# EAGLE board uClouds_002 (EAGLE 7.1.0)
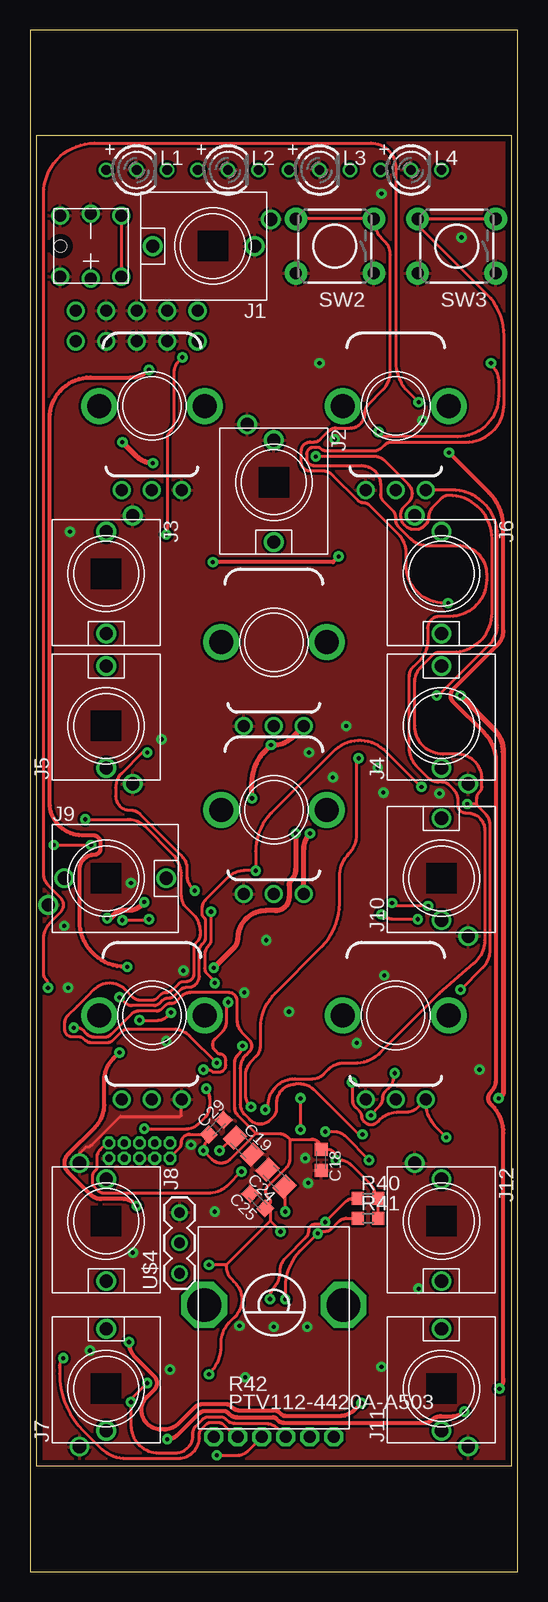
[diagram p4: board, top side]
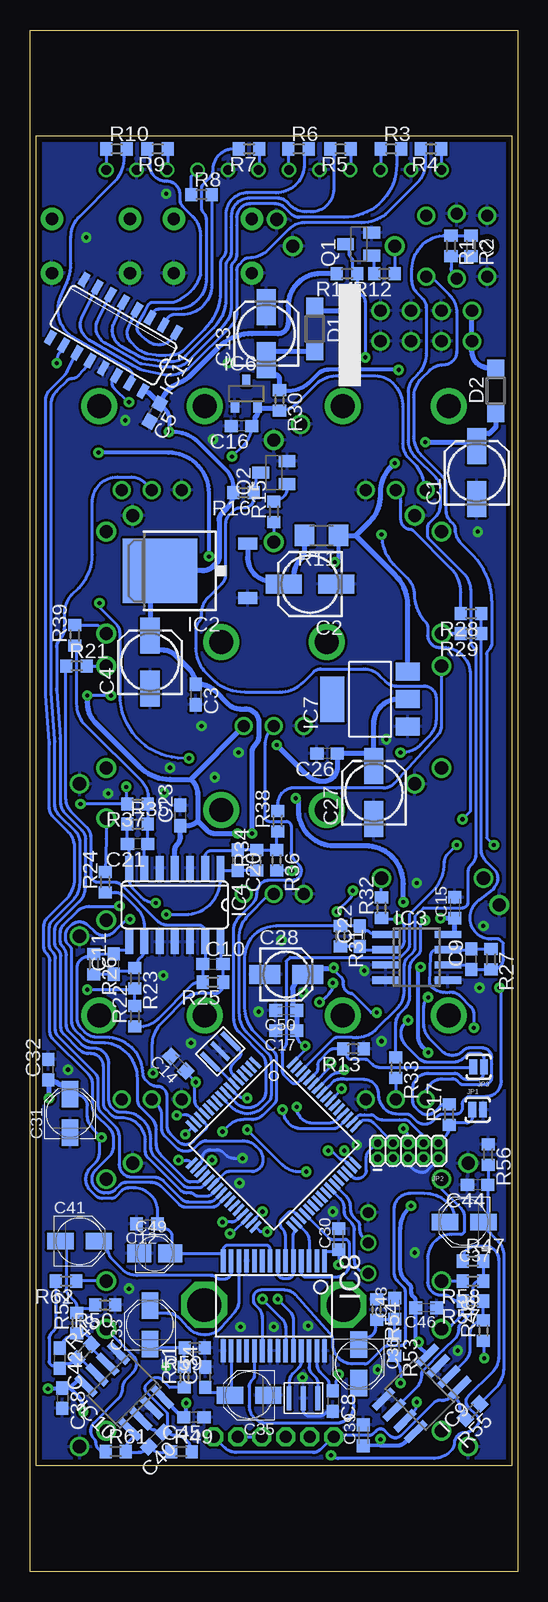
[diagram p5: board, bottom side, seen from below]

Size 40.64 x 128.5 mm. Coordinates in mm from the lower left corner, seen from the top.
Outline: 0.5,8.8 40.14,8.8 40.14,119.7 0.5,119.7 0.5,8.8
Outline: 0,0 40.64,0 40.64,128.5 0,128.5 0,0
Copper layers (1*16): Top 0.035mm / dielectric 1.5mm / Bottom 0.035mm
Design rules "pcbCartStandars *": minimum track width 8mil, minimum drill 0.4mm, track to track 8mil, track to pad 8mil, pad to pad 8mil, via to via 8mil, smd to smd 8mil, copper to edge 20mil, drill to drill 8mil, minimum pad ring 8mil, minimum via ring 10mil, stop-mask expansion 3mil, vias tented up to drill 25mil, thermal gap 8mil

## Footprints (pad centres in the part's own frame; a part is rotated, then mirrored left to right if it is on the bottom)
Q-POT2 = drill 1 pad 1.5: P$1 -2.5,-7; P$2 0,-7; P$3 2.5,-7 | drill 2 pad 2.5: P$4 -4.4,0; P$5 4.4,0
153CLV-0505 = smd 3 x 1.6: + 2.2,0; - -2.2,0
C0603 = smd 1.1 x 1: 1 -0.85,0; 2 0.85,0
C0603K = smd 1.05 x 1.08: 1 -0.875,0; 2 0.875,0
C0805K = smd 1.3 x 1.6: 1 -1,0; 2 1,0
153CLV-0405 = smd 2.6 x 1.6: + 1.8,0; - -1.8,0
PANASONIC_B = smd 2.2 x 1.4: + 1.6,0; - -1.6,0
PANASONIC_A = smd 2 x 1.5: + 1.3,0; - -1.3,0
SOD123 = smd 1.4 x 1.4: A 1.9,0; C -1.9,0
FIDUCIAL-1X2 = smd 1 x 1: 1 0,0
TO252 = smd 1 x 1.6: 1 -2.28,-4.8; 2 2.28,-4.8 | smd 5.4 x 6.2: 3 0,2.5
SO08 = smd 0.6 x 2.2: 1 -1.905,-2.6; 2 -0.635,-2.6; 3 0.635,-2.6; 4 1.905,-2.6; 5 1.905,2.6; 6 0.635,2.6; 7 -0.635,2.6; 8 -1.905,2.6
SO14 = smd 0.66 x 2.032: 1 -3.81,-3.073; 2 -2.54,-3.073; 3 -1.27,-3.073; 4 0,-3.073; 5 1.27,-3.073; 6 2.54,-3.073; 7 3.81,-3.073; 8 3.81,3.073; 9 2.54,3.073; 10 1.27,3.073; 11 0,3.073; 12 -1.27,3.073; 13 -2.54,3.073; 14 -3.81,3.073
TQFP-10X10-64 = smd 1.2 x 0.3: 1 -5.936,3.75; 2 -5.936,3.25; 3 -5.936,2.75; 4 -5.936,2.25; 5 -5.936,1.75; 6 -5.936,1.25; 7 -5.936,0.75; 8 -5.936,0.25; 9 -5.936,-0.25; 10 -5.936,-0.75; 11 -5.936,-1.25; 12 -5.936,-1.75; 13 -5.936,-2.25; 14 -5.936,-2.75; 15 -5.936,-3.25; 16 -5.936,-3.75; 33 5.886,-3.75; 34 5.886,-3.25; 35 5.886,-2.75; 36 5.886,-2.25; 37 5.886,-1.75; 38 5.886,-1.25; 39 5.886,-0.75; 40 5.886,-0.25; 41 5.886,0.25; 42 5.886,0.75; 43 5.886,1.25; 44 5.886,1.75; 45 5.886,2.25; 46 5.886,2.75; 47 5.886,3.25; 48 5.886,3.75 | smd 0.3 x 1.2: 17 -3.75,-5.911; 18 -3.25,-5.911; 19 -2.75,-5.911; 20 -2.25,-5.911; 21 -1.75,-5.911; 22 -1.25,-5.911; 23 -0.75,-5.911; 24 -0.25,-5.911; 25 0.25,-5.911; 26 0.75,-5.911; 27 1.25,-5.911; 28 1.75,-5.911; 29 2.25,-5.911; 30 2.75,-5.911; 31 3.25,-5.911; 32 3.75,-5.911; 49 3.75,5.936; 50 3.25,5.936; 51 2.75,5.936; 52 2.25,5.936; 53 1.75,5.936; 54 1.25,5.936; 55 0.75,5.936; 56 0.25,5.936; 57 -0.25,5.936; 58 -0.75,5.936; 59 -1.25,5.936; 60 -1.75,5.936; 61 -2.25,5.936; 62 -2.75,5.936; 63 -3.25,5.936; 64 -3.75,5.936
DBZ_R-PDSO-G3 = smd 0.7 x 1: 1 -0.95,-1.1; 2 0.95,-1.1; 3 0,1.1
SOT223 = smd 1.499 x 2.007: 1 -2.261,-3.15; 2 0.025,-3.15; 3 2.311,-3.15 | smd 3.81 x 2.007: 4 0,3.15
SSOP28 = smd 0.381 x 1.905: 1 -4.55,-3.752; 2 -3.9,-3.752; 3 -3.25,-3.752; 4 -2.6,-3.752; 5 -1.95,-3.752; 6 -1.3,-3.752; 7 -0.65,-3.752; 8 0,-3.752; 9 0.65,-3.752; 10 1.3,-3.752; 11 1.95,-3.752; 12 2.6,-3.752; 13 3.25,-3.752; 14 3.9,-3.752; 15 3.9,3.752; 16 3.25,3.752; 17 2.6,3.752; 18 1.95,3.752; 19 1.3,3.752; 20 0.65,3.752; 21 0,3.752; 22 -0.65,3.752; 23 -1.3,3.752; 24 -1.95,3.752; 25 -2.6,3.752; 26 -3.25,3.752; 27 -3.9,3.752; 28 -4.55,3.752
SO16 = smd 0.6 x 1.2: 1 -4.445,-2.8; 2 -3.175,-2.8; 3 -1.905,-2.8; 4 -0.635,-2.8; 5 0.635,-2.8; 6 1.905,-2.8; 7 3.175,-2.8; 8 4.445,-2.8; 9 4.445,2.8; 10 3.175,2.8; 11 1.905,2.8; 12 0.635,2.8; 13 -0.635,2.8; 14 -1.905,2.8; 15 -3.175,2.8; 16 -4.445,2.8
S_JACK_S2_INV = drill 1.1: GND 2.223,-4.826; NORM 0,-3.5; TIP 0,5
S_JACK_SMALL2 = drill 1.1: GND -2.223,-4.826; NORM 0,-3.5; TIP 0,5
SJ_2S-NO = smd 0.635 x 1.27: 1 -0.45,0; 2 0.45,0
2X5-1.27 = drill 0.61 pad 1.067 octagon: 1 -1.27,3.81; 2 0,3.81; 3 -1.27,2.54; 4 0,2.54; 5 -1.27,1.27; 6 0,1.27; 7 -1.27,0; 8 0,0; 9 -1.27,-1.27; 10 0,-1.27
LED_3MM_3PIN = drill 0.813: A 0,0; C1 -2.54,0; C2 2.54,0
SOT23-BEC = smd 1 x 1.4: B -0.95,-1.1; C 0,1.1; E 0.95,-1.1
CRYSTAL_SMALLER = smd 0.4 x 2: GND 0,0; X1 -1.2,0; X2 1.2,0
R0603 = smd 1 x 1.1: 1 -0.85,0; 2 0.85,0
R1206 = smd 1.6 x 1.803: 1 -1.422,0; 2 1.422,0
BOURNS_PTV112 = drill 1 pad 1.6 octagon: 1 -3,-11; 1P -1,-11; 2 -5,-11; 2P 1,-11; 3 5,-11; 3P 3,-11 | drill 2.8 pad 3.81 octagon: P$1 5.8,0; P$5 -5.8,0
TACTILE-PTH = drill 1.016 pad 1.88: 1 -3.251,2.261; 2 3.251,2.261; 3 -3.251,-2.261; 4 3.251,-2.261
PB6149L = drill 1: 1 2.54,-2.54; 2 2.54,2.54; 3 -2.54,-2.54; 4 -2.54,2.54; A 0,-2.7; K 0,2.7 | hole 1: -2.54,0
EURO_POWER2 = drill 1.016: GND1 -1.27,2.54; GND2 1.27,2.54; GND3 -1.27,0; GND4 1.27,0; GND5 -1.27,-2.54; GND6 1.27,-2.54; V+ -1.27,5.08; V++ 1.27,5.08; V- -1.27,-5.08; V-- 1.27,-5.08
1X3_SMALL = drill 0.9: 1 -2.54,0; 2 0,0; 3 2.54,0

## Placement (x,y rotation side)
BLEND  B10K  [Q-POT2]  30.48,97.16 0 top
C1  47u  [153CLV-0505]  3.41,91.6 90 bottom
C2  47u  [153CLV-0505]  17.3,82.31 180 bottom
C3  100n  [C0603]  26.83,73.1 270 bottom
C4  47u  [153CLV-0505]  30.64,75.8 90 bottom
C5  100n  [C0603]  30.24,96.6 240 bottom
C8  100n  [C0603]  15.4,14.21 270 bottom
C9  1n  [C0603]  3.89,51.04 90 bottom
C10  1n  [C0603]  25.4,50.64 0 bottom
C11  1n  [C0603]  33.66,50.64 90 bottom
C12  1u  [C0603K]  30.88,28.97 180 bottom
C13  47u  [153CLV-0505]  20.95,103.19 90 bottom
C14  100n  [C0603K]  28.28,42.33 135 bottom
C15  100n  [C0603K]  5.24,55.32 90 bottom
C16  100n  [C0603]  23.02,95.49 180 bottom
C17  100n  [C0603K]  19.29,45.09 180 bottom
C18  100n  [C0603K]  24.25,34.31 270 top
C19  2.2u  [C0805K]  17.8,35.46 315 top
C20  1n  [C0603]  23.34,59.29 270 bottom
C21  1n  [C0603]  31.67,60.64 180 bottom
C22  1n  [C0603]  13.18,52.94 90 bottom
C23  100n  [C0603]  28.1,63.02 90 bottom
C24  2.2u  [C0805K]  20.51,32.78 135 top
C25  100n  [C0603K]  18.97,30.88 135 top
C26  100n  [C0603]  15.88,68.18 180 bottom
C27  47u  [153CLV-0505]  11.99,64.93 90 bottom
C28  10u  [153CLV-0405]  19.29,49.77 0 bottom
C29  100n  [C0603K]  15.51,37.04 45 top
C30  100n  [C0603K]  14.92,27.7 90 bottom
C31  10u  [PANASONIC_B]  37.31,38.18 90 bottom
C32  100n  [C0603]  39.13,41.83 90 bottom
C33  10u  [PANASONIC_B]  30.64,20.56 90 bottom
C34  100n  [C0603]  26.04,16.19 90 bottom
C35  10u  [PANASONIC_B]  22.38,14.68 180 bottom
C36  10u  [PANASONIC_B]  13.26,17.3 270 bottom
C37  10u  [PANASONIC_B]  4.45,29.13 180 bottom
C38  100n  [C0603]  37.94,14.45 270 bottom
C39  100n  [C0603K]  12.86,11.35 90 bottom
C40  18p  [C0603]  30.14,10.99 225 bottom
C41  10u  [PANASONIC_B]  36.51,27.54 0 bottom
C42  18p  [C0603]  38.18,17.78 270 bottom
C43  220p  [C0603K]  10.24,21.91 90 bottom
C44  220p  [C0603]  3.33,32.23 180 bottom
C45  100n  [C0603]  26.99,12.86 180 bottom
C46  100n  [C0603K]  7.62,21.99 180 bottom
C49  10u  [PANASONIC_A]  30.24,26.51 0 bottom
C50  1u  [C0603K]  19.29,46.75 180 bottom
D1  1N5819HW  [SOD123]  16.91,103.58 270 bottom
D2  1N5819HW  [SOD123]  1.83,98.42 90 bottom
DENSITY  B10K  [Q-POT2]  10.16,46.35 0 top
F1  FIDUCIAL1X2  [FIDUCIAL-1X2]  -110.49,107.95 0 bottom  (outside the outline)
F2  FIDUCIAL1X2  [FIDUCIAL-1X2]  -107.95,107.95 0 bottom  (outside the outline)
F3  FIDUCIAL1X2  [FIDUCIAL-1X2]  -105.41,107.95 0 bottom  (outside the outline)
F4  FIDUCIAL1X2  [FIDUCIAL-1X2]  -102.87,107.95 0 bottom  (outside the outline)
IC2  LM1117-3.3  [TO252]  27.3,83.42 90 bottom
IC3  MCP6002  [SO08]  8.41,51.2 270 bottom
IC4  MCP6004  [SO14]  28.57,55.56 180 bottom
IC5  STM32F405RGT6  [TQFP-10X10-64]  20.32,35.56 315 bottom
IC6  LM4040B10  [DBZ_R-PDSO-G3]  22.62,98.19 0 bottom
IC7  LM1117-3.3  [SOT223]  12.3,72.71 90 bottom
IC8  WM8731  [SSOP28]  20.64,22.15 180 bottom
IC9  TL072D  [SO08]  8,14.86 135 bottom
IC10  TL072D  [SO08]  32.78,15.01 45 bottom
IC11  74LS595D  [SO16]  33.68,103.06 150 bottom
J1  S_JACK_S2_INV  [S_JACK_S2_INV]  15.24,110.49 90 top
J2  S_JACK_S2_INV  [S_JACK_S2_INV]  20.32,90.81 180 top
J3  S_JACK_SMALL2  [S_JACK_SMALL2]  6.35,83.19 180 top
J4  S_JACK_S2_INV  [S_JACK_S2_INV]  34.29,70.48 0 top
J5  S_JACK_S2_INV  [S_JACK_S2_INV]  6.35,70.48 0 top
J6  S_JACK_S2_INV  [S_JACK_S2_INV]  34.29,83.19 180 top
J7  S_JACK_SMALL2  [S_JACK_SMALL2]  6.35,15.24 0 top
J8  S_JACK_S2_INV  [S_JACK_S2_INV]  6.35,29.21 180 top
J9  S_JACK_S2_INV  [S_JACK_S2_INV]  6.35,57.78 270 top
J10  S_JACK_S2_INV  [S_JACK_S2_INV]  34.29,57.78 0 top
J11  S_JACK_S2_INV  [S_JACK_S2_INV]  34.29,15.24 0 top
J12  S_JACK_S2_INV  [S_JACK_S2_INV]  34.29,29.21 180 top
JP1  [SJ_2S-NO]  3.33,38.5 0 bottom
JP2  M05X2MINIJTAG  [2X5-1.27]  7.86,35.72 90 bottom
JP3  [SJ_2S-NO]  3.25,42.07 180 bottom
L1  [LED_3MM_3PIN]  8.89,116.84 0 top
L2  [LED_3MM_3PIN]  16.51,116.84 0 top
L3  [LED_3MM_3PIN]  24.13,116.84 0 top
L4  [LED_3MM_3PIN]  31.75,116.84 0 top
PITCH  B10K  [Q-POT2]  20.32,63.5 0 top
POSITION  B10K  [Q-POT2]  10.16,97.16 0 top
Q1  MMBT3904  [SOT23-BEC]  13.26,110.65 90 bottom
Q2  MMBT3904  [SOT23-BEC]  20.32,91.6 90 bottom
Q3  8MHz  [CRYSTAL_SMALLER]  24.79,43.36 45 bottom
R1  68  [R0603]  5.56,110.49 270 bottom
R2  68  [R0603]  3.89,110.49 270 bottom
R3  68  [R0603]  10.56,118.59 0 bottom
R4  68  [R0603]  7.22,118.59 180 bottom
R5  68  [R0603]  14.76,118.59 180 bottom
R6  68  [R0603]  18.26,118.59 0 bottom
R7  68  [R0603]  22.38,118.59 180 bottom
R8  68  [R0603]  26.35,114.78 0 bottom
R9  68  [R0603]  30,118.59 180 bottom
R10  68  [R0603]  33.42,118.59 0 bottom
R11  4.7  [R1206]  16.35,86.36 180 bottom
R12  100k  [R0603]  11.11,108.19 180 bottom
R13  10k  [R0603]  13.7,43.57 180 bottom
R14  10k  [R0603]  14.21,108.19 180 bottom
R15  100k  [R0603]  20.32,88.34 90 bottom
R16  10k  [R0603]  22.86,89.93 180 bottom
R17  10k  [R0603]  5.71,38.1 90 bottom
R21  100k  [R0603]  36.75,75.49 0 bottom
R22  200k  [R0603]  31.91,46.28 90 bottom
R23  200k  [R0603]  31.91,49.45 270 bottom
R24  100k  [R0603]  34.37,57.47 90 bottom
R25  33k  [R0603]  25.4,49.13 180 bottom
R26  33k  [R0603]  35.32,50.64 270 bottom
R27  66.5k  [R0603]  2.22,51.04 270 bottom
R28  200k  [R0603]  3.89,79.85 180 bottom
R29  100k  [R0603]  3.89,78.18 180 bottom
R30  470  [R0603]  19.84,97.63 270 bottom
R31  66.5k  [R0603]  14.76,52.94 270 bottom
R32  100k  [R0603]  11.35,55.32 90 bottom
R33  200k  [R0603]  10.16,41.99 270 bottom
R34  47k  [R0603]  21.75,59.29 90 bottom
R35  33k  [R0603]  31.67,62.31 0 bottom
R36  180k  [R0603]  20.08,59.29 270 bottom
R37  200k  [R0603]  31.67,63.98 180 bottom
R38  100k  [R0603]  20,62.55 90 bottom
R39  100k  [R0603]  36.91,78.03 90 bottom
R40  2.2k  [R0603]  28.18,31.11 0 top
R41  2.2k  [R0603]  28.18,29.45 0 top
R42  PTV112-4420A-A503  [BOURNS_PTV112]  20.32,22.23 0 top
R46  3.3k  [R0603]  2.86,20.08 90 bottom
R47  3.3k  [R0603]  3.73,25.88 0 bottom
R48  39k  [R0603]  36.12,18.33 45 bottom
R49  39k  [R0603]  28.03,9.99 0 bottom
R50  39k  [R0603]  34.37,22.23 180 bottom
R51  5.6k  [R0603]  27.78,16.19 90 bottom
R52  5.6k  [R0603]  36.75,20.72 90 bottom
R53  5.6k  [R0603]  10.24,18.81 270 bottom
R54  5.6k  [R0603]  11.75,21.83 270 bottom
R55  5.6k  [R0603]  3.76,13.37 225 bottom
R56  5.6k  [R0603]  2.46,34.77 270 bottom
R57  22k  [R0603]  3.73,22.54 180 bottom
R58  22k  [R0603]  3.73,24.21 180 bottom
R59  39k  [R0603]  26.91,18.65 180 bottom
R61  1.0k  [R0603]  33.5,10 0 bottom
R62  1.0k  [R0603]  37.62,24.21 180 bottom
SIZE  B10K  [Q-POT2]  20.32,77.47 0 top
SW2  [TACTILE-PTH]  25.4,110.49 180 top
SW3  [TACTILE-PTH]  35.56,110.49 180 top
TEXTURE  B10K  [Q-POT2]  30.48,46.35 0 top
U$1  PB6149_FIXED  [PB6149L]  5.08,110.49 0 top
U$2  EURO_POWER2  [EURO_POWER2]  8.89,103.82 90 top
U$3  12.288MHz  [CRYSTAL_SMALLER]  17.86,14.45 0 bottom
U$4  1X3_SMALL  [1X3_SMALL]  12.46,27.38 90 top

## Tracks (layer width: path | path; a pad name or v marks a point on that pad's centre or on a via)
+3V3  (via drill 0.35)
  Top 0.25: 25.53,34.21 v25.48,34.29 | 20,29.21 20,30 19.89,30.12 C25.1 19.94,30.61 arc90 19.94,31.09 19.83,31.21 arc-90 19.83,32.13 21.4,33.7 arc45 21.67,34.35 21.67,36.04 | 20,29.21 v20.88,28.34 | R41.2 R40.2 28.73,31.41 28.73,31.48 arc45 28.43,32.21 26.76,33.88 arc45 25.78,34.29 v25.48,34.29 | 18.83,36.51 18.11,35.79 17.13,34.81 16.69,34.37 arc-90 15.16,34.37 v14.45,35.08 14.53,35.16 14.53,35.37 arc-45 14.71,35.83 14.81,35.93 C29.1 14.85,36.46 13.31,36.46 arc90 12.61,35.75 12.61,35.65 arc-45 12.46,35.29 11.67,34.5 JP2.1 | 18.83,36.51 20.73,36.51 arc-45 21.52,36.18 21.67,36.04 | 20,29.21 16.35,25.56 | 16.35,25.56 v14.92,25.56 | 16.35,25.56 16.35,25.46 arc45 16.8,24.38 17.04,24.14 arc-90 17.04,21.18 16.57,20.72 arc45 15.91,19.11 15.91,18.8 arc-45 v14.92,16.43 | v9.13,45.96 10.66,45.96 arc45 11.43,46.27 v11.75,46.59 | 18.83,36.51 17.35,37.99 arc-45 17.07,38.68 17.07,42.5 arc-45 17.26,42.98 17.28,43 arc36 v17.7,43.81 | v17.7,43.81 | v38.42,100.73 38.42,100.65 arc-45 39.05,99.11 39.05,98 arc-90 35.64,94.59 29.47,94.59 v29.05,95.01 | 21.67,36.04 23.48,36.04 arc-90 24.29,35.23 C18.1 24.28,35.16 24.86,35.16 arc-90 25.48,34.54 v25.48,34.29
  Top 0.406: v22.15,61.52 22.15,58.54 arc-45 21.78,57.66 arc45 21.59,57.2 21.59,56.21 arc-90 20.46,55.09 19.64,55.09 arc90 17.3,52.75 arc-45 16.99,51.99 v15.32,50.32
  Bottom 0.25: IC5.19 v25.48,34.29 | IC5.32 21.46,28.34 v20.88,28.34 | IC5.48 14.45,34.99 v14.45,35.08 | 18.02,44.69 C17.1 18.41,44.71 arc-45 18.18,44.15 17.61,43.58 | 14.92,26.59 v14.92,25.56 | 14.92,26.59 C30.1 | IC8.1 16.09,26.62 16.03,26.67 15,26.67 14.92,26.59 | v14.92,16.43 14.92,16.11 15.04,16 arc-45 15.16,15.7 15.16,15.3 C8.1 15.72,15.38 15.72,15.58 arc-45 15.92,16.08 16.45,16.61 arc45 16.74,17.3 IC8.27 | v9.13,45.96 9.4,45.69 arc-45 9.71,44.95 9.71,44.84 arc-45 9.28,43.8 8.23,42.76 arc-45 7.47,42.44 5.4,42.44 arc-45 4.49,42.82 4.24,43.06 arc45 3.96,43.18 3.18,43.18 arc90 2.8,42.8 JP3.1 2.86,42.02 2.86,41.5 arc90 3.32,41.04 4.26,41.04 arc45 4.71,41.22 4.85,41.37 arc-45 5.26,41.54 7.42,41.54 arc-90 8.74,40.22 8.74,39.2 arc-45 8.53,38.7 8.15,38.33 arc-90 6.92,38.33 6.51,38.74 arc45 6,38.95 R17.2 | v11.75,46.59 12.21,46.59 13.75,48.13 arc-45 13.88,48.18 arc45 14.18,48.31 14.32,48.45 arc45 14.53,48.95 14.53,49.13 arc-45 14.7,49.54 15.4,50.24 | IC11.10 38.18,101.62 arc-30 v38.42,100.73 | 17.61,43.58 IC5.64 | 17.61,43.58 v17.7,43.81
  Bottom 0.35: R16.2 23.71,90.39 arc-45 24.3,91.82 26.66,94.17 arc-45 28.68,95.01 v29.05,95.01 29.05,96.07 arc-45 29.41,96.92 C5.1
  Bottom 0.406: IC11.16 arc45 30.65,98.17 C5.1 29.4,98.12 arc35 28.73,98.8 27.92,99.21 arc-18 27.27,99.69 24.93,102.03 arc45 22.14,103.19 19.97,103.19 arc-90 19.13,104.03 19.13,105.5 arc90 16.44,108.19 R14.2 | C17.1 C50.1 18.76,47.09 18.76,48.55 arc45 18.64,48.83 arc-45 18.57,48.99 18.57,49.13 17.94,49.77 C28.+ | 18.41,49.61 18.26,49.77 C28.+ | C28.+ 16.91,49.77 16.43,50.24 15.4,50.24 v15.32,50.32 | v22.15,61.52 22.15,68.32 arc45 21.93,68.86 arc-45 21.57,69.72 21.57,70.77 arc-90 22.71,71.91 23.15,71.91 arc45 24.15,72.33 25.25,73.43 arc-45 26.58,73.98 26.81,73.98 | R16.2 arc45 24.25,88.62 24.64,88.23 arc-45 24.88,87.64 24.88,84.49 arc45 25.04,84.11 25.35,83.8 arc45 26.26,83.42 IC2.3 30.64,82.59 C4.+ 30.64,77.31 30.16,76.83 29.63,76.83 arc45 28.5,76.37 27.4,75.26 arc45 26.91,74.08 26.81,73.98 | 26.81,73.98 C3.1
+3V3_A  (via drill 0.35)
  Top 0.25: v34.69,36.2 33.87,37.01 arc-45 32.98,39.16 TEXTURE.P$3 32.33,38.7 arc-45 31.3,38.28 30.73,38.28 arc45 29.04,37.58 28.9,37.43 arc-90 27.94,37.43 27.79,37.58 arc-45 27.66,37.89 arc45 27.48,38.34 27.14,38.67 arc-45 26.9,39.25 26.9,40.73 v26.83,40.8 | v33.89,73.03 34.02,73.03 38.31,77.31 arc45 38.95,78.86 38.95,86.35 arc90 35.15,90.16 BLEND.P$3
  Top 0.406: SIZE.P$3 21.93,69.58 arc-45 20.28,68.9 v20.08,68.9 19.63,68.44 arc45 18.49,65.7 v18.49,64.45 | v6.43,54.45 6.68,54.45 7.17,54.95 arc-45 7.61,55.13 8.27,55.13 arc45 9.26,55.54 v9.53,55.8 | PITCH.P$3 22.82,60.27 arc-45 v23.34,61.52 | v35.88,73.03 38.62,70.28 arc-45 39.43,68.33 39.43,39.83 v39.05,39.45
  Bottom 0.25: IC8.8 20.64,26.87 arc-90 20.99,27.23 24.13,27.23 arc-90 24.53,26.83 24.53,26.51 | 24.53,26.51 24.53,25.91 IC8.14 | 24.53,26.51 C49.+ 28.23,26.67 28.65,26.67 28.81,26.83 28.81,27.95 arc-90 29.43,28.57 29.61,28.57 C12.1 30,29.99 arc-90 31.99,31.98 32.43,31.98 arc-45 32.98,31.75 33.49,31.23 arc45 33.81,31.1 34.65,31.1 arc45 35.17,31.32 35.57,31.71 arc90 35.57,33.7 35.19,34.08 arc-45 34.83,34.95 34.83,36.05 v34.69,36.2 35.36,36.87 arc45 35.87,38.1 35.87,38.81 arc-90 36.84,39.78 C31.+ | C14.1 27.66,41.63 v26.83,40.8 26.9,40.73 26.9,39.27 arc-45 26.68,38.74 IC5.13 | v33.89,73.03 v35.88,73.03
  Bottom 0.406: IC4.4 28.57,60.16 arc45 28.4,60.58 arc-45 28.1,61.31 C23.1 27.57,62.17 arc-45 26.67,62.55 | 22.78,70.43 SIZE.P$3 27.25,66.04 | 11.99,67.87 11.99,70.68 arc90 9.94,72.73 IC7.2 | 11.99,67.87 C27.+ | 11.99,67.87 12.3,68.18 C26.1 15.03,67.04 arc90 16.2,65.86 arc45 17.64,66.45 v20.08,68.9 | IC3.8 5.16,53.1 5.24,53.18 C15.1 v6.43,54.45 | v9.53,55.8 9.53,57.34 arc-90 12.67,60.48 15.28,60.48 arc90 18.26,63.46 18.26,64.21 v18.49,64.45 | 27.25,66.04 28.99,66.04 arc45 31.53,67.09 35.15,70.71 arc45 35.88,72.47 v35.88,73.03 | v39.05,39.45 39.05,40.9 C32.1 38.95,40.8 38.58,40.8 arc45 38.3,40.68 arc-45 38.01,40.56 37.62,40.56 37.31,40.24 C31.+ | 26.67,62.55 25.92,61.8 arc-45 25.24,61.52 v23.34,61.52 | 27.25,66.04 27.14,65.93 arc45 26.67,64.8 26.67,62.55
AREF_-10  (via drill 0.35)
  Top 0.25: v35.88,48.5 37.73,50.35 arc45 38.34,51.83 38.34,62.21 arc45 37.94,63.19 37.23,63.9 | 37.23,63.9 37.15,63.98 v36.43,63.98 | 37.23,63.9 37.23,64.47 arc-45 37.42,64.94 37.48,64.99 arc45 37.67,65.45 37.67,66.06 arc90 35.59,68.14 34.41,68.14 arc-90 32.07,70.48 32.07,74.19 arc-45 32.56,75.39 33.6,76.43 arc-45 34.11,76.64 35.24,76.64 arc90 38.5,79.9 38.5,86.1 arc90 34.9,89.7 arc45 34.27,89.44 33.57,88.74 arc45 33.22,87.91 arc-45 32.96,87.27 32.8,87.11 arc-45 32.19,86.86 32.01,86.86 arc-45 31.29,87.16 31.18,87.26 arc-45 30.91,87.91 30.91,88.19 arc-45 31.12,88.7 31.56,89.13 arc90 31.56,90.6 29.59,92.57 arc45 28.68,92.95 v23.81,92.95 | v32.62,65.41 29.7,68.33 arc90 25.23,68.33 20.12,63.22 arc45 18.81,60.06 v18.81,58.42 17.83,58.42 arc45 16.52,57.88 14.61,55.97 arc45 14.32,55.27 14.32,54.89 arc45 14.46,54.56 14.57,54.45 arc-45 14.63,54.3 14.63,52.8 arc-45 14.46,52.41 14.36,52.3 arc45 14.11,51.69 14.11,49.61 arc-90 13.21,48.71 13.08,48.71 arc45 12.52,48.48 12.05,48.02 arc-45 11.54,47.8 11.5,47.8 arc45 11.07,47.63 10.82,47.37 arc-45 10.32,47.17 8.49,47.17 arc-45 7.92,47.4 v7.46,47.86
  Bottom 0.25: R22.2 R23.2 32.01,48.5 v35.88,48.5 | 32.78,63.98 v36.43,63.98 | 32.78,63.98 R37.2 | v23.81,92.95 22.8,93.96 arc-45 C16.1 | R30.2 arc-45 18.37,97.39 16.75,99.01 arc45 15.16,99.67 11.85,99.67 arc45 10.41,99.07 arc45 9.58,97.07 9.58,93.98 arc-45 9.11,92.85 8.62,92.36 arc45 7.82,90.42 7.82,90.32 POSITION.P$1 | DENSITY.P$1 7.66,39.67 arc90 6.25,41.08 5.47,41.08 arc45 5.03,40.9 4.81,40.69 arc-45 4.57,40.58 2.75,40.58 arc-90 2.16,41.18 2.16,41.3 2.16,42.31 2.16,42.87 arc-90 2.93,43.63 4.06,43.63 arc-45 4.5,43.45 4.57,43.38 arc90 6.31,43.38 7.32,44.39 arc45 7.82,45.59 7.82,47 arc45 v7.46,47.86 | v18.81,58.42 20.06,58.42 R36.2 | v32.62,65.41 32.62,64.14 32.78,63.98
  Bottom 0.406: R30.2 20.11,96.78 20.32,97 21.58,97 IC6.2 21.67,96.6 arc45 21.79,96.32 21.81,96.3 arc-45 21.91,96.06 21.91,95.75 C16.1
BLEND_CV  (via drill 0.35)
  Top 0.25: v33.18,55.48 30.74,55.48 arc-45 v30.16,55.72
  Bottom 0.25: R35.1 C21.2 32.38,60.51 IC4.7 32.38,57.85 arc-45 31.95,56.8 31.37,56.22 arc-45 v30.16,55.72 | 25.77,32.62 IC5.21 26.24,32.11 arc45 26.48,32.01 27.37,32.01 arc45 27.92,32.24 30.25,34.57 arc45 30.57,35.35 30.57,36.07 arc-90 32.78,38.28 33.14,38.28 arc45 33.63,38.48 33.83,38.68 arc45 34.06,39.24 34.06,42.34 arc-90 35.33,43.62 35.57,43.62 arc45 36.33,43.94 37.35,44.96 arc45 37.62,45.59 37.62,51.38 arc-45 37.9,52.08 37.94,52.11 arc45 38.12,52.55 38.12,53.24 arc45 37.85,53.89 36.72,55.03 arc45 35.73,55.44 33.22,55.44 v33.18,55.48
BLEND_POT
  Bottom 0.25: IC5.23 25.48,31.46 arc45 25.93,31.27 26.57,31.27 arc45 27.01,31.46 arc-45 27.26,31.56 27.59,31.56 arc45 28.09,31.77 30.79,34.47 arc45 31.02,35.04 31.02,35.85 arc-90 32.99,37.82 33.31,37.82 arc45 33.83,38.04 34.29,38.5 arc45 34.51,39.03 34.51,42.08 arc-90 35.6,43.17 35.75,43.17 arc45 36.52,43.48 37.84,44.81 arc45 38.07,45.36 38.07,51.31 arc-45 38.27,51.81 38.4,51.93 arc45 38.57,52.35 38.57,53.48 arc45 38.34,54.05 36.53,55.85 arc-45 36.01,57.11 36.01,61.03 arc-45 36.33,61.81 37.7,63.17 arc45 38.12,64.19 38.12,69.31 arc-4 38.13,69.51 38.42,73.43 arc4 38.43,73.63 38.43,77.04 arc45 38.15,77.72 arc-45 37.79,78.59 37.79,79.88 arc45 37.15,81.42 36.58,81.99 arc-45 35.44,84.73 35.44,89.16 arc90 33.37,91.23 32.16,91.23 arc45 31.13,90.81 BLEND.P$2
BOOT_FLASH
  Bottom 0.25: JP3.2 3.62,41.99 11.42,41.99 | IC5.60 16.83,41.52 arc-45 16.67,41.92 16.67,42.24 arc45 16.51,42.62 15.73,43.4 arc45 15.32,43.57 R13.2 14.21,43.23 14.21,42.98 arc-90 13.91,42.69 12.72,42.69 arc45 12.39,42.55 12.11,42.27 arc-45 11.42,41.99 | 11.42,41.99
DENSITY_CV  (via drill 0.35)
  Top 0.25: v24.61,36.67 25.41,36.67 arc-45 26.21,36.34 v28.26,34.29
  Bottom 0.25: IC3.1 11.87,53.1 arc45 12.34,53.29 arc-45 12.64,53.42 12.8,53.42 C22.2 R31.1 20.15,53.79 arc-90 22.77,51.18 22.77,46.97 arc-45 21.94,44.97 20.34,43.37 arc45 20.1,42.8 20.1,39.45 arc45 20.29,38.99 21.25,38.03 arc45 22.13,37.67 22.84,37.67 arc-45 24.15,37.12 v24.61,36.67 | v28.26,34.29 27.66,34.29 arc45 27.23,34.11 IC5.17
GND  (via drill 0.35)
  Top 0.25: J8.GND 4.13,34.85 4.68,35.4 4.92,35.4 5.08,35.56 5.16,35.56 7.54,37.94 12.54,37.94 12.62,38.02 12.62,39.32 DENSITY.P$3
  Bottom 0.25: JP2.9 6.59,34.37 7.53,33.43 arc45 7.94,33.26 arc90 JP2.5 | IC5.18 26.35,34.13 arc-45 26.27,34.31 26.27,34.48 arc90 25.59,35.16 25.09,35.16 arc45 24.54,34.93 24.38,34.78 arc-45 23.58,34.45 v22.94,34.45 | C8.2 15.54,13.36 arc-45 16.07,13.14 arc45 16.55,12.94 17.35,12.94 arc90 17.86,13.45 U$3.GND
  other vias: 35.96,111.2 29.29,114.86 32.7,95.96 25.4,94.38 24.13,100.73 3.33,86.68 26.35,70.48 29.45,64.93 34.13,64.85 28.97,66.99 25.24,66.2 23.26,68.26 10.95,69.37 8.41,57.39 2.86,53.82 3.17,48.66 12.78,50.09 21.59,46.67 27.23,44.05 17.86,48.26 19.68,52.63 11.35,44.21 13.41,35.56 23.18,32.38 37.47,41.83 15.4,30 8.57,26.59 5,18.41 11.67,16.83 17.94,16.19 17.46,20.48 20.32,20.4 23.1,20.4 29.29,17.07 29.53,49.69 32.38,23.57
  pour Top: 40.14,119.7 0.5,119.7 0.5,8.8 40.14,8.8
  pour Bottom: 40.14,119.7 0.5,119.7 0.5,8.8 40.14,8.8
I2C_SCL  (via drill 0.35)
  Top 0.25: R40.1 26.99,31.11 arc45 26.31,30.83 v24.61,29.13 24.41,28.93 23.72,28.93 arc90 23.21,28.43 arc-45 22.96,27.8 21.27,26.12 arc45 20.82,25.03 20.82,25 arc-45 20.2,23.51 arc45 20,23.03 v20,22.7
  Bottom 0.25: IC5.29 23.37,29.33 arc45 23.85,29.13 v24.61,29.13 | v20,22.7 19,21.7 arc45 18.69,20.94 IC8.24
I2C_SDA  (via drill 0.35)
  Top 0.25: R41.1 26.38,29.45 arc45 25.72,29.18 25.09,28.54 arc-45 24.68,28.37 24.17,28.37 v23.97,28.18 22.51,26.71 arc45 21.27,23.73 v21.27,22.7
  Bottom 0.25: IC5.30 23.81,28.18 v23.97,28.18 | v21.27,22.7 19.65,21.08 arc45 19.34,20.32 IC8.23
I2S_LRCK
  Bottom 0.25: IC5.33 18.57,28.51 18.57,28.34 18.58,28.33 arc-45 18.69,28.07 IC8.5 18.69,24.87 arc90 19.11,24.45 19.55,24.45 arc90 19.99,24.89 IC8.7
I2S_SCK
  Bottom 0.25: IC5.34 17.68,28.32 arc45 17.39,27.62 IC8.3
I2S_SIN
  Bottom 0.25: IC8.6 19.34,27.92 arc-45 19.61,28.58 arc90 19.61,29.44 19.16,29.89 arc90 18.54,29.89 IC5.35
I2S_SOUT
  Bottom 0.25: IC5.36 15.75,27.81 arc-45 15.5,27.7 14.39,27.7 arc90 14.05,27.37 14.05,25.65 arc90 15.17,24.53 17.62,24.53 arc90 18.02,24.92 18.02,25.88 IC8.4
JTCK
  Bottom 0.25: JP2.4 10.73,36.05 10.73,36.11 12,37.38 arc-45 12.59,37.62 12.8,37.62 arc-45 13.06,37.52 IC5.49
JTDI
  Bottom 0.25: 12.77,38.08 | IC5.50 13.32,37.97 arc45 13.05,38.08 12.77,38.08 | 12.77,38.08 12.22,38.08 arc45 11.95,37.96 11.91,37.92 arc-45 11.26,37.66 9.85,37.66 9.84,37.67 9.46,37.67 arc45 9.03,37.49 8.1,36.56 arc45 7.86,35.97 JP2.8
JTDO  (via drill 0.35)
  Top 0.25: v9.53,36.91 13.02,36.91 arc45 14.1,37.35 14.55,37.81 arc45 15,38.9 15,39.34 arc34 14.76,40.12 v14.68,40.24
  Bottom 0.25: JP2.6 9.13,36.18 arc-45 9.37,36.75 v9.53,36.91 | v14.68,40.24 14.81,40.01 IC5.55
JTMS
  Bottom 0.25: IC5.46 13.76,32.89 arc-45 13.51,32.78 13.3,32.78 arc-90 12.61,33.47 12.61,34.53 arc45 12.39,35.05 12.06,35.39 12,35.39 JP2.2
LED_DATA  (via drill 0.35)
  Top 0.25: v1.51,48.66 1.51,48.9 arc45 1.29,49.43 arc-45 1.13,49.8 1.13,52.62 arc-45 1.78,54.19 2.54,54.95 arc90 2.54,56.18 1.58,57.14 arc-45 1.13,58.22 1.13,114.83 arc-90 5.37,119.07 28.43,119.07 arc-90 30.48,117.02 30.48,100.83 arc45 31.5,98.35 v32.38,97.47
  Bottom 0.25: v1.51,48.66 1.35,48.5 1.35,40.91 arc90 2.65,39.61 3.93,39.61 arc-90 4.6,38.94 4.6,38.67 arc90 5.15,38.12 6.26,38.12 arc-45 6.65,37.96 7.04,37.57 arc90 8.47,37.57 8.88,37.98 arc-45 9.23,38.12 9.97,38.12 arc90 11.58,39.73 11.58,39.78 arc-90 12.8,41 14.24,41 arc-45 15.32,40.88 15.76,40.44 16.28,39.92 IC5.57 | v32.38,97.47 32.46,97.47 33.6,98.61 arc90 33.6,99.52 IC11.14
LED_EN
  Bottom 0.25: 24.71,31.56 IC5.24 25.2,31.03 arc45 25.71,30.82 27.44,30.82 arc45 28.02,31.06 29.53,32.56 arc-45 30.29,32.88 32.14,32.88 arc90 33.22,33.96 33.22,36.4 arc-45 33.5,37.07 34.68,38.24 arc45 34.97,38.94 34.97,40.95 arc-45 35.21,41.53 38.31,44.63 arc45 38.52,45.15 38.52,51.1 arc-45 38.74,51.63 38.85,51.74 arc45 39.02,52.17 39.02,53.65 arc45 38.78,54.25 37.09,55.94 arc-45 36.47,57.44 36.47,60.77 arc-45 36.84,61.67 38.21,63.04 arc45 38.57,63.92 38.57,69.11 arc-4 38.58,69.34 38.88,73.25 arc4 38.88,73.43 38.88,97.22 arc45 38.36,98.48 37.55,99.29 arc45 37.14,99.46 arc-47 36.62,99.69 36.12,100.22 arc-11 35.96,100.42 IC11.12
LED_REC
  Bottom 0.25: R1.1 R2.1 | R1.1 6.21,111.34 | 7.5,86.98 7.5,86.36 arc-45 7.39,86.1 4.52,83.22 arc45 3.89,81.7 3.89,77.45 arc-45 3.73,77.08 arc45 3.49,76.49 3.49,59.78 arc45 3.84,58.95 3.94,58.85 arc-45 4.13,58.39 4.13,55.81 arc90 4.61,55.32 7.85,55.32 8.54,54.63 8.54,52.06 arc45 8.72,51.62 9.17,51.17 arc-45 9.45,50.51 9.45,48.4 arc45 10.05,46.94 11.78,45.22 arc45 13.43,44.53 13.8,44.53 14.98,44.53 arc-45 15.43,44.34 IC5.62 | 7.5,86.98 arc45 7.3,87.47 6.83,87.95 arc-45 6.43,88.91 6.43,90.23 arc-45 6.84,91.21 8.56,92.94 arc45 9.13,94.3 9.13,98.32 arc45 8.66,99.45 8.38,99.73 arc-45 7.62,101.56 7.62,105.34 arc-45 7.95,106.14 8.37,106.56 arc45 8.81,107.62 8.81,108.56 arc90 6,111.36 5.58,111.36 R1.1 | 7.5,86.98 7.5,87.04
LED_SCK
  Bottom 0.25: IC5.25 24.94,30.59 arc45 25.47,30.37 27.69,30.37 arc45 28.16,30.56 29.64,32.04 arc-45 30.58,32.43 32.62,32.43 arc-45 33.16,32.21 33.58,31.79 arc45 34.15,31.56 34.43,31.56 arc45 35.01,31.79 35.15,31.94 arc90 35.15,33.48 34.02,34.61 arc-45 33.67,35.45 33.67,36.13 arc-45 34.01,36.94 35.15,38.08 arc45 35.42,38.72 35.42,40.64 arc-45 35.74,41.43 38.77,44.46 arc45 38.97,44.95 38.97,50.87 arc-45 39.23,51.48 39.26,51.51 arc45 39.48,52.04 39.48,53.8 arc45 39.2,54.46 37.62,56.05 arc-45 36.92,57.73 36.92,60.36 arc-45 37.45,61.64 38.72,62.91 arc45 39.02,63.65 39.02,68.92 arc-4 39.03,69.15 39.33,73.08 arc4 39.34,73.23 39.34,97.64 arc45 38.98,98.5 37.78,99.69 arc-18 37.52,100.05 IC11.11 36.99,101.33
LIN
  Bottom 0.25: IC8.20 21.29,21.14 arc-45 21.64,22 21.86,22.22 arc45 22.03,22.62 22.03,22.84 arc90 21.41,23.46 19.43,23.46 arc45 18.55,23.09 15.6,19.82 arc45 15.41,19.09 15.41,19.06 arc-90 13.81,17.3 12.76,17.3 arc-45 12.38,17.46 11.19,18.66 arc45 10.77,18.83 9.69,18.83 arc-90 9.36,19.16 9.36,20.3 9.37,20.31 9.37,23.34 arc-45 9.54,23.74 10.04,24.24 arc45 10.32,24.92 10.32,30.16 arc90 8.97,31.51 7.78,31.51 arc45 5.75,30.67 arc45 5.24,29.43 5.24,29.37 5.48,29.13 C37.+
LOUT
  Bottom 0.25: IC8.12 23.24,22.62 arc45 23.71,21.47 24.69,20.35 arc96 27.44,20.32 28.12,21.06 arc-45 29.2,21.51 30.48,21.51 30.64,21.67 C33.+
LOUT_JACK
  Bottom 0.25: J11.TIP 32.09,18.04 arc90 32.09,16.57 32.64,16.02 arc-45 32.94,15.29 arc45 33.31,14.39 35.34,12.37 arc-90 35.34,11.12 35.31,11.09 arc45 35.16,10.73 arc-90 34.43,10 R61.1
N$1
  Bottom 0.25: R21.2 J4.TIP
N$2
  Bottom 0.25: R22.1 31.89,45.4 31.58,45.4 arc-45 29.97,46.07 27.18,48.86 arc39 26.71,49.08 R25.2 C10.1 26.04,50.86 IC4.13 26.04,53.33 arc-90 26.6,53.9 29.14,53.9 arc45 30.07,54.28 33.01,57.22 arc-45 33.61,57.47 35,57.47 arc90 35.56,58.03 35.56,61.24 arc-45 35.87,61.98 37.13,63.24 arc45 37.67,64.54 37.67,75.42 R21.1
N$3
  Bottom 0.25: Q3.X1 24.88,41.75 arc45 24.69,41.67 23.66,40.64 IC5.6
N$4
  Bottom 0.25: J10.TIP 34.29,61.1 R24.2
N$5
  Bottom 0.25: R26.2 C11.1 33.44,50.01 32.31,50.01 32.01,50.3 R23.1 31.67,50.54 31.67,50.76 arc45 31.53,51.1 31.3,51.33 arc-45 31.11,51.78 IC4.9 31.11,53.82 arc-45 31.73,55.3 32.67,56.24 arc-45 33.59,56.62 R24.1
N$6
  Bottom 0.25: R39.2 34.98,78.88 J6.TIP
N$7
  Bottom 0.25: IC8.25 18.04,17.5 arc45 18.25,17 18.75,16.5 arc-45 19.05,15.77 19.05,13.66 U$3.X1
N$8
  Bottom 0.25: IC5.5 23.74,41.45 arc90 23.74,42.3 23.2,42.84 arc-90 23.2,43.52 23.89,44.21 Q3.X2
N$9
  Bottom 0.25: R9.1 29.15,116.9 L4.C1
N$10
  Bottom 0.25: J5.TIP 6.35,70.63 arc45 6.79,69.56 10.3,65.69 arc48 11.18,65.3 15.1,65.3 arc45 15.16,65.33 18.64,65.33 arc-90 20,63.96 R38.2
N$11
  Bottom 0.25: IC4.2 26.04,59.62 arc90 25.57,60.09 23.39,60.09 C20.1 R34.2 R36.1 20.08,61.62 R38.1
N$12
  Bottom 0.25: R10.1 34.27,116.86 L4.C2
N$13  (via drill 0.35)
  Top 0.25: v15.8,35.08 16.88,36.16 C19.1
  Bottom 0.25: IC5.47 14.39,34.22 arc-45 14.64,34.33 14.64,34.33 arc45 14.84,34.41 15.52,35.08 v15.8,35.08
N$14
  Bottom 0.25: R32.2 J9.TIP
N$15
  Bottom 0.25: IC4.6 31.11,60.35 C21.1 R35.2 R37.1 30.8,64 30.8,64.61 arc-45 31.3,65.83 36.04,70.57 arc45 36.77,72.34 36.77,76.84 R39.1
N$16
  Bottom 0.25: R8.1 27.2,116.31 L3.C2
N$17
  Bottom 0.25: IC8.16 23.89,14.78 C35.+ 24.22,14.92 25.64,14.92 26.04,15.32 C34.1
N$18
  Bottom 0.25: R56.2 2.46,32.25 C44.1 2.48,29.49 2.69,29.28 | 2.69,29.28 C37.- | R55.1 1.83,15.3 arc-45 1.13,16.98 1.13,26.28 arc-45 1.66,27.57 2.21,28.11 arc45 2.69,29.28
N$19  (via drill 0.35)
  Top 0.25: v21.27,30 21.27,31.39 C24.1
  Bottom 0.25: IC5.31 v21.27,30
N$20
  Bottom 0.25: J8.TIP R58.2
N$21
  Bottom 0.25: J7.TIP 6.24,20.24 arc-45 5.48,20.55 4.92,21.11 arc-45 4.58,21.94 R57.2 4.87,22.54 arc45 5.57,22.83 arc-45 6.11,23.06 6.43,23.06 arc90 7.5,24.13 7.5,26.11 arc90 5.51,28.1 4.73,28.1 arc-90 4.45,28.39 4.45,29.58 arc-45 4.74,30.3 6.35,31.91 J8.NORM
N$22
  Bottom 0.25: C36.- 13.26,19.05 12.78,19.53 12.62,19.53 arc-90 11.83,20.32 11.83,20.5 R54.2 10.24,20.98 | 10.24,20.98 9.9,20.98 C43.1 | R53.1 10.24,20.98
N$23
  Bottom 0.25: R50.2 35.54,21.91 36.27,21.91 36.62,21.57 R52.2 36.75,22.06 arc-45 36.98,22.61 37.42,23.06 arc45 37.62,23.54 37.62,27.05 C41.-
N$24  (via drill 0.35)
  Top 0.25: v7.7,54.29 9.84,54.29 v9.92,54.37
  Bottom 0.25: R31.2 C22.1 12.91,51.83 IC3.2 10.18,51.83 arc-90 9.45,52.56 9.45,53.9 v9.92,54.37 11.25,54.37 R32.1 | R33.1 10.16,45.59 arc45 9.73,46.62 9.42,46.93 arc-45 8.99,47.96 8.99,50.28 arc45 8.69,51.01 8.27,51.43 arc-45 8.09,51.88 8.09,53.91 v7.7,54.29
N$25
  Bottom 0.25: IC10.6 35.52,18.65 R48.2 35.64,19.05 35.64,19.45 35.88,19.68 arc-45 36.32,19.87 R52.1 36.89,19.87 37.23,19.53 37.32,19.53 arc-90 37.94,18.91 37.94,18.87 C42.1
N$26
  Bottom 0.25: R33.2 DENSITY.P$2
N$27
  Bottom 0.25: R29.2 J3.TIP
N$28
  Bottom 0.25: IC10.7 36.39,17.73 R48.1 36.86,17.59 arc45 37.54,17.3 37.78,17.3 38.16,16.93 C42.2 38.44,16.93 38.66,17.14 arc90 39.05,17.54 39.05,19.4 arc45 38.85,19.88 38.67,20.07 arc-45 38.47,20.54 R62.2
N$29
  Bottom 0.25: R7.1 21.53,116.9 L3.C1
N$30
  Bottom 0.25: R28.1 R29.1 3.04,60.2 arc-45 2.62,59.19 2.2,58.76 1.93,58.5 arc90 1.93,57.07 2.06,56.87 3.17,56 arc-45 3.24,55.97 3.45,55.76 arc-90 3.45,53.22 arc-45 2.24,52.72 1.62,52.72 arc45 1.47,52.65 1.31,52.49 arc23 1.19,52.37 1.19,51.51 1.19,51.04 arc90 1.98,50.24 2.17,50.24 R27.2 C9.1 4.26,50.56 IC3.6
N$31
  Bottom 0.25: R51.2 27.78,18.63 R59.2 30.33,18.65 C33.-
N$32
  Bottom 0.25: IC10.2 30.6,11.94 arc-45 30.34,11.83 arc45 30.18,11.76 30.01,11.59 C40.1 29.35,11.78 | R51.1 29,15.34 29.63,15.98 arc-90 30.54,15.98 30.93,15.59 arc-90 30.93,14.95 29.23,13.25 arc45 29.17,13.1 29.17,12.21 arc45 29.35,11.78 | 29.35,11.78 | R49.2 arc-90 28.62,11.35 arc45 29.15,11.57 29.35,11.78
N$33
  Bottom 0.25: IC10.1 31.99,11.53 31.99,11.27 32.38,10.88 arc-45 32.65,10.24 32.65,9.94 31.59,9.94 arc-45 30.9,10.23 C40.2 arc-45 29.59,9.91 R49.1
  Bottom 0.406: R61.2 32.65,9.94
N$34
  Bottom 0.25: R6.1 19.11,116.9 L2.C2
N$35
  Bottom 0.25: R28.2 4.74,81.64 arc-45 5.56,83.62 8.72,86.78 arc-45 8.9,86.86 arc90 9.73,87.68 9.73,89.11 arc-45 POSITION.P$2
N$36
  Bottom 0.25: R15.1 J2.TIP
N$37
  Bottom 0.25: Q2.B 19.22,90.29 arc90 20.22,89.3 R15.2
N$38
  Bottom 0.25: R2.2 R1.2 5.56,108.67 arc-45 5.27,107.98 U$1.A
N$39
  Bottom 0.25: R5.1 13.91,116.9 L2.C1
N$40
  Bottom 0.25: R3.1 11.41,116.86 L1.C2
N$41
  Bottom 0.25: R4.1 6.37,116.86 L1.C1
N$42  (via drill 0.35)
  Top 0.25: R42.2P 20.58,11.96 arc45 19.64,12.35 17.12,12.35 arc-45 16.35,12.67 16.29,12.73 arc45 15.91,12.89 14.86,12.89 arc45 14.39,12.7 13.82,12.12 arc45 13.58,11.54 13.58,11.43 arc-90 12.19,9.89 10.71,9.89 arc-90 8.41,12.18 v8.41,14.13 8.41,14.37 v9.76,15.72
  Bottom 0.25: v9.76,15.72 9.76,16.6 arc-45 10.15,17.53 10.16,17.54 R53.2 | 9.42,12.57 IC9.7 8.69,13.27 arc-45 8.41,13.95 v8.41,14.13 | R42.3P R42.2P
N$43
  Bottom 0.25: IC11.15 32.15,99.39 arc-88 32.38,100.19 36.94,102.8 arc84 38.07,106.26 37.58,107.39 arc-24 37.23,109.05 37.23,111.22 arc45 36.51,112.95 33.62,115.85 arc-45 32.78,117.86 32.78,118.37 R10.2
N$44
  Bottom 0.25: R9.2 30.85,118.56 30.48,118.19 30.64,118.03 30.64,117.21 arc-90 29.32,115.89 29.25,115.89 arc90 28.13,114.77 28.13,114.35 arc-45 27.89,113.79 27.06,112.95 arc45 26.41,111.38 26.41,108.07 arc52 28.67,105.81 30.42,105.81 arc-60 30.73,105.63 31.1,104.99 31.55,104.21 31.55,104.2 31.63,104.06 arc-77 31.49,103.17 30.98,102.69 arc-101 28.59,103.02 IC11.1
N$45
  Bottom 0.25: R8.2 25.5,107.24 arc90 27.96,104.78 28.57,104.78 arc-61 29.27,104.36 IC11.2
N$46
  Bottom 0.25: R7.2 23.68,118.59 arc-90 25.4,116.87 arc45 25.7,116.14 26.24,115.61 arc-45 26.35,115.33 26.35,113.68 arc-45 26.18,113.25 arc45 25.96,112.72 25.96,107.73 arc90 28.46,105.23 29.89,105.23 arc-61 30.43,104.91 IC11.3
N$47
  Bottom 0.25: R6.2 17.41,118.56 17.78,118.19 17.78,117.3 arc90 20.15,114.92 22.51,114.92 arc-90 24.32,113.11 24.32,110.14 arc45 24.59,109.51 arc-45 24.78,109.05 24.78,106.7 arc45 26.08,103.56 27.71,101.92 arc15 28.16,101.58 arc38 28.98,101.39 29.35,101.34 29.93,101.37 29.95,101.37 | 29.95,101.37 | 29.95,101.37 30.11,101.39 30.83,101.5 arc17 31.12,101.58 arc5 31.36,101.71 arc15 31.79,102.04 32.21,102.46 arc71 32.43,103.73 IC11.4
N$48
  Bottom 0.25: R5.2 15.61,118.4 15.32,118.11 15.32,115.25 arc90 17.24,113.33 17.61,113.33 arc45 18.98,113.9 19.25,114.17 arc-45 19.98,114.47 22.36,114.47 arc-90 23.87,112.96 23.87,112.04 23.87,109.98 arc45 24.15,109.3 arc-45 24.32,108.88 24.32,107.33 24.32,106.08 arc45 25.32,103.68 27.65,101.35 arc45 28.88,100.84 29.35,100.84 arc8 29.54,100.85 29.99,100.92 | 29.99,100.92 | 29.99,100.92 30.91,101.05 arc17 31.3,101.17 31.45,101.24 31.85,101.47 | 31.85,101.47 | 31.85,101.47 | 31.85,101.47 31.86,101.47 32.19,101.66 | 32.19,101.66 | 32.19,101.66 33.01,102.12 arc85 33.63,104.08 IC11.5
N$49
  Bottom 0.25: R3.2 9.71,118.56 10.08,118.19 10.08,117.29 arc90 14.49,112.88 18.18,112.88 arc45 18.9,113.18 19.37,113.65 arc-45 20.26,114.02 22.26,114.02 arc-90 23.42,112.86 23.42,112.22 23.42,109.82 arc45 23.71,109.1 arc-45 23.87,108.72 23.87,107.52 23.87,105.49 arc45 24.58,103.78 27.46,100.89 arc45 28.69,100.39 29.38,100.39 arc8 29.58,100.4 31.31,100.65 arc22 31.44,100.7 31.61,100.79 31.61,100.8 31.74,100.88 | 31.74,100.88 | 31.74,100.88 31.77,100.89 31.92,100.98 31.93,100.98 34.37,102.38 arc87 34.97,104.37 IC11.6
N$50
  Bottom 0.25: R4.2 8.07,118.56 7.7,118.19 7.7,117.33 arc45 8.32,115.82 10.81,113.34 arc45 13,112.43 17.77,112.43 arc-45 19.09,111.88 20.8,110.17 arc45 22.42,109.5 22.43,109.5 arc-45 22.85,109.32 23.22,108.95 arc-45 23.42,108.47 23.42,107.7 23.42,104.97 arc45 23.89,103.83 27.29,100.42 arc59 29.58,99.79 30.95,100.06 arc17 31.68,100.31 31.84,100.4 32,100.5 35.72,102.63 | 35.72,102.63 arc13 35.72,102.63 | 35.72,102.63 35.73,102.63 36.02,102.93 arc72 36.29,104.6 IC11.7
N$51
  Bottom 0.25: IC9.1 5.4,14.77 5.4,14.76 | 5.4,14.76 5.4,14.68 5.13,14.41 arc45 4.84,13.73 arc-45 4.62,13.19 4.37,12.94 R55.2 | 5.4,14.76 5.61,14.55 arc45 6.25,14.29 6.38,14.29 arc-45 7.07,14 8.07,13 | R42.3 24.43,10.33 arc-45 23.44,9.92 17.05,9.92 arc-45 16.4,10.19 15.37,11.22 R42.2 14.88,11.35 12.36,11.35 arc-45 12.06,11.47 11.79,11.74 arc90 11.07,11.74 10.65,11.32 arc-90 9.75,11.32 8.07,13 | 8.07,13
N$52  (via drill 0.35)
  Top 0.25: v15.56,9.68 17.29,9.68 arc45 18.13,10.03 R42.1P
  Bottom 0.25: R47.1 4.58,26.02 arc90 3.46,27.15 2.77,27.15 arc90 1.59,25.96 1.59,17.89 arc45 2.11,16.62 4.14,14.59 arc-90 4.14,13.75 3.41,13.01 arc90 3.41,12.15 3.69,11.87 arc45 4.41,11.57 4.42,11.57 arc-90 5.28,10.71 arc45 5.53,10.11 5.65,9.99 arc45 6.99,9.43 14.95,9.43 arc45 v15.56,9.68
N$53  (via drill 0.35)
  Top 0.25: v2.78,17.78 arc45 2.46,17.01 2.46,16.49 arc45 4.43,11.74 5.84,10.33 arc45 8.01,9.43 12.4,9.43 arc90 14.11,11.23 14.11,11.47 arc-45 14.27,11.85 14.68,12.26 arc-45 15.1,12.43 15.68,12.43 arc-45 16.14,12.24 17.15,11.22 R42.1
  Bottom 0.25: v2.78,17.78 2.78,19.15 R46.1
N$54
  Bottom 0.25: R47.2 R58.1 3.17,24.21 arc-90 3.73,23.65 3.73,21.9 arc45 3.9,21.49 4.82,20.58 arc-45 4.92,20.33 4.92,20.16 arc45 5.22,19.43 6.18,18.46 7.91,16.73 arc-45 8.01,16.5 8.01,16.41 arc45 8.48,15.28 IC9.6
N$55
  Bottom 0.406: R11.2 17.77,85.15 arc45 18.09,84.38 arc-45 18.65,83.03 18.65,82.39 19.42,82.39 C2.+ 19.74,82.55 20.51,82.55 arc90 22.5,84.54 IC2.2
N$57
  Bottom 0.25: J1.TIP 10.24,108.21 R12.1
N$58
  Bottom 0.25: R57.1 2.86,22.52 R46.2 arc-90 3.97,19.82 3.97,18.46 arc45 4.3,17.67 IC9.2
N$59
  Bottom 0.25: IC8.26 17.39,17.04 arc-45 17.19,16.55 16.88,16.25 arc45 16.67,15.73 16.67,13.66 U$3.X2
N$60
  Bottom 0.406: D2.A 2.4,100.33 arc90 3.81,101.73 U$2.V+ U$2.V++
N$61
  Bottom 0.406: D1.C 16.74,105.09 U$2.V-- U$2.V-
N$66
  Bottom 0.25: R12.2 11.96,109.51 Q1.B
PITCH_POT
  Bottom 0.25: PITCH.P$2 arc-45 20.89,56.26 22.41,54.74 arc-45 23.22,52.8 23.22,46.48 arc-45 22.6,44.99 20.77,43.16 arc45 20.55,42.64 20.55,39.65 arc45 20.75,39.17 21.23,38.7 arc90 23.81,38.7 IC5.9
PLAY  (via drill 0.35)
  Top 0.25: v14.45,41.83 14.81,41.83 arc-45 15.21,41.66 arc45 15.29,41.63 15.75,41.63 arc90 16.32,42.2 16.32,42.62 arc90 15.79,43.14 arc-45 15.66,43.2 15.44,43.42 arc-90 15.44,44.41 16.02,45 arc45 16.39,45.88 16.39,47.23 16.51,47.35 v16.51,47.47 | v9.76,68.26 9.37,68.26 7.64,66.54 arc45 7.14,65.34 7.14,64.61 arc90 8.29,63.46 8.42,63.46 arc-45 9.16,63.16 12.61,59.7 arc-45 13.07,58.59 13.07,58.02 arc45 13.51,56.98 v13.73,56.75 | v15.08,55.01 15.08,52.64 arc-45 14.9,52.2 14.88,52.18 arc45 14.56,51.41 14.56,50.28 arc45 14.75,49.82 15.4,49.17 v15.4,49.05 15.32,48.97
  Bottom 0.25: Q2.C 21.51,91.6 21.83,91.28 21.83,90.11 R16.1 22.01,89.43 arc90 22.78,88.66 23.09,88.66 arc-45 23.72,88.4 24.05,88.07 arc-45 24.35,87.34 24.35,83.09 arc45 24.66,82.33 25.81,81.19 arc-45 26.38,79.81 26.38,79.66 arc45 26.59,79.13 arc-45 26.83,78.57 26.83,76.97 arc-45 25.97,74.9 25.55,74.48 arc-45 22.75,73.32 19.8,73.32 arc-45 17.88,74.12 17.01,74.98 arc45 16.38,75.25 12.83,75.25 arc45 11.52,74.71 11,74.19 arc-45 10.12,73.82 7.79,73.82 arc90 6.8,72.83 6.8,70.97 arc45 7.36,69.63 8.07,68.92 arc45 9.66,68.26 v9.76,68.26 | IC5.58 16.62,40.29 15.69,41.22 arc45 14.89,41.61 arc-45 14.37,41.83 v14.45,41.83 | v13.73,56.75 arc45 14.01,56.08 v15.08,55.01 | v15.4,49.05 arc52 15.96,47.9 v16.51,47.47
POSITION_POT_CV  (via drill 0.35)
  Top 0.25: v27.7,36.43 27.38,36.43 23.64,40.18 arc45 22.56,40.63 22.12,40.63 arc90 20.56,39.06 20.56,38.58 arc-45 20.28,37.9 20.05,37.67 arc-90 18.31,37.67 17.84,38.14 arc-45 17.52,38.92 17.52,41.94 arc-45 17.98,43.06 17.98,43.05 17.99,43.05 18.01,43.06 18.03,43.07 18.04,43.08 18.29,43.34 arc90 18.29,44.3 17.76,44.82 arc-45 17.27,46.02 17.27,47.56 arc90 16.56,48.26 13.38,48.26 arc45 12.62,47.94 12.19,47.52 arc-45 11.79,47.35 11.69,47.35 arc45 11.26,47.17 10.97,46.89 arc-45 10.55,46.72 9.05,46.72 arc45 8.46,46.47 6.76,44.77 arc-45 6.18,44.53 5.43,44.53 arc-45 4.7,44.83 4.38,45.15 arc45 3.97,45.32 v3.65,45.32
  Bottom 0.25: R27.1 C9.2 3.95,51.83 IC3.7 6.77,51.83 arc-90 7.24,51.36 7.32,49 arc-45 7.22,48.75 7.13,48.67 arc-45 5.69,48.26 5.43,48.26 arc45 4.7,47.88 3.93,47.11 arc45 3.65,46.44 v3.65,45.32 | IC5.16 27.17,36.97 v27.7,36.43
REC  (via drill 0.35)
  Top 0.25: v12.7,101.2 12.36,100.87 arc45 11.99,99.95 11.99,95.8 arc-45 11.65,94.99 arc45 11.43,94.46 11.43,86.52 v11.35,86.44 | v4.6,62.71 8.15,62.71 arc-45 9.54,62.13 11.88,59.79 arc-45 12.62,58.02 12.62,56.33 arc45 13.03,55.35 13.65,54.72 arc-45 14.18,53.47 14.18,53.09 arc-45 13.94,52.52 13.84,52.43 arc45 13.66,51.97 13.66,49.82 arc-90 13,49.17 12.8,49.17 arc45 12.39,49 11.88,48.49 arc-45 11.33,48.26 11.27,48.26 arc45 10.91,48.1 10.58,47.78 arc-45 10.21,47.62 9.17,47.62 arc-45 8.56,47.87 7.93,48.51 arc90 5.33,48.51 4.72,47.9 | v15.56,42.39 13.32,44.62 arc45 11.92,45.2 8.21,45.2 arc45 7.57,44.94 6.9,44.27 arc-45 6.43,44.07 5.12,44.07 arc-45 4.6,44.29 4.49,44.4 arc45 4.08,44.57 3.52,44.57 arc-90 2.89,45.19 2.89,45.7 arc-45 3.16,46.34 3.93,47.11 4.72,47.9 | 4.72,47.9
  Bottom 0.25: Q1.C 14.05,110.34 14.05,109.89 arc-45 13.91,109.56 13.85,109.5 arc45 13.73,109.21 13.73,108.51 13.41,108.19 R14.1 13.36,107.06 arc-45 13.16,106.59 12.95,106.38 arc45 12.7,105.77 v12.7,101.2 | v11.35,86.44 11.35,86.42 arc-45 10.32,83.94 9.15,82.77 arc45 8.62,81.49 arc-45 7.63,79.1 arc45 7.5,78.79 7.5,78.05 arc-90 6.49,77.03 6.19,77.03 arc90 3.95,74.79 3.95,63.36 v4.6,62.71 | IC5.59 15.56,42.09 v15.56,42.39
RESET  (via drill 0.35)
  Top 0.25: v17.62,33.34 16.55,32.27 arc-45 14.84,31.56 6.18,31.56 arc-45 5.66,31.77 5.36,32.07 arc-45 5.2,32.47 5.2,32.9 arc-45 5.4,33.39 5.5,33.49 arc45 5.57,33.66 5.57,34.48 arc-45 5.86,35.17 6.59,35.91 JP2.10 | v22.54,36.83 v22.54,39.45
  Bottom 0.25: JP2.10 6.08,36.22 arc-45 5.71,37.11 R17.1 5.58,37.39 4.25,37.39 arc-90 3.78,37.85 JP1.1 | v22.54,36.83 19.68,33.97 arc-45 18.15,33.34 v17.62,33.34 | v22.54,39.45 22.67,39.45 arc45 23.49,39.79 IC5.7
RIN
  Bottom 0.25: IC8.19 21.94,16.35 arc45 22.07,16.03 22.15,15.95 arc-45 22.38,15.38 22.38,13.85 arc-90 20.92,12.38 15.12,12.38 arc-90 13.65,13.85 13.65,15.15 C36.+
ROUT
  Bottom 0.25: IC8.13 23.89,24.93 arc90 24.45,24.37 24.77,24.37 arc45 25.17,24.53 arc-45 25.54,24.69 31.72,24.69 arc45 32.99,25.21 33.72,25.94 arc45 34.21,27.12 34.21,27.38 34.29,27.46 34.83,27.46 C41.+
ROUT_JACK
  Bottom 0.25: J12.TIP R62.1
RX
  Bottom 0.25: U$4.2 12.77,27.69 arc45 13.15,28.61 13.15,28.86 arc-45 13.27,29.15 13.6,29.48 arc45 13.93,30.27 13.93,30.44 arc-45 14.28,31.28 IC5.43
SIZE_CV  (via drill 0.35)
  Top 0.25: v28.42,38.02 29.13,38.81 arc45 29.4,39.47 29.4,39.49 arc-45 29.62,40.02 29.86,40.26 arc45 v30.39,41.55
  Bottom 0.25: IC4.14 24.77,50.86 C10.2 R25.1 24.55,48.9 arc90 25.27,48.18 25.32,48.18 26.67,48.18 arc-45 27.6,47.8 29.72,45.68 arc-45 30.48,43.84 30.48,41.76 arc-45 v30.39,41.55 | 26.85,37.46 IC5.15 27.21,37.85 arc-50 27.8,38.07 v28.42,38.02
SIZE_POT
  Bottom 0.25: IC5.8 23.45,39.05 arc-90 21.52,39.05 21.26,39.3 arc-45 21.01,39.92 21.01,42.32 arc-45 21.31,43.06 23.22,44.97 arc45 23.67,46.06 23.67,53.36 arc45 23.13,54.66 22.01,55.79 arc-45 21.74,56.43 21.74,56.55 arc90 20.67,57.62 18.77,57.62 arc-90 18.05,58.33 18.05,58.53 arc-45 18.2,58.88 18.62,59.3 arc45 18.89,59.94 18.89,62.14 arc-90 19.27,62.53 20.74,62.53 arc90 21.03,62.83 21.03,68.92 arc45 20.44,70.35 SIZE.P$2
SW_LOAD  (via drill 0.35)
  Top 0.25: SW3.3 SW3.4 32.31,112.23 38.09,106.45 arc-45 39.51,103.03 39.51,97.32 arc-90 36.32,94.14 30.09,94.14 arc45 29.53,93.91 29.29,93.67 arc-45 28.66,93.4 24.7,93.4 arc-45 24.24,93.59 24.19,93.64 arc45 24.04,93.7 23.62,93.7 arc90 23.05,93.14 23.05,92.82 arc90 23.69,92.19 27.61,92.19 arc-90 29.21,90.59 29.21,89.79 arc45 29.45,89.22 30.23,88.43 arc-45 30.46,87.88 30.46,87.62 arc45 30.66,87.15 31.67,86.14 arc45 33.13,85.53 35.66,85.53 arc-90 38.05,83.14 38.05,82.67 arc-90 34.99,79.61 34.12,79.61 arc90 33.14,78.63 33.14,77.58 arc-45 32.45,75.92 31.93,75.4 arc45 31.61,74.63 31.61,68.68 arc45 32.29,67.05 33.19,66.15 arc45 34.03,65.8 34.32,65.8 arc-45 34.95,65.54 35.31,65.18 arc-45 35.68,64.29 35.68,63.85 arc90 36.31,63.22 36.5,63.22 arc-90 37.89,61.83 37.89,52.62 arc-45 37.16,50.85 37.03,50.72 34.12,48.18 29.25,43.3 arc-45 27.03,42.39 26.1,42.39 arc45 24.91,41.89 24.49,41.48 arc-45 23.54,41.08 22.07,41.08 arc90 19.84,38.86 19.84,38.73 v19.61,38.5
  Bottom 0.25: IC5.51 14.88,37.11 arc45 15.36,36.91 18.02,36.91 arc90 19.53,38.42 v19.61,38.5
SW_MODE  (via drill 0.35)
  Top 0.25: SW2.4 SW2.3 arc45 29.33,111.1 29.56,110.88 arc-45 30.03,109.75 30.03,99.98 arc-45 29.41,98.5 28.24,97.33 arc45 27.91,96.52 arc-90 26.71,95.33 25.52,95.33 arc45 24.87,95.06 24.2,94.39 arc-45 23.65,94.16 23.36,94.16 arc90 22.6,93.4 22.6,92.44 arc90 23.3,91.74 24.34,91.74 arc-45 25.25,91.36 27.35,89.26 arc45 27.79,89.08 arc-45 28.3,88.86 30.72,86.44 arc-45 31.35,84.92 31.35,83.87 arc90 34.5,80.72 v34.85,80.72 | v18.41,38.73 18.36,38.79 arc-45 17.97,39.72 17.97,41.36 arc-45 18.46,42.55 18.83,42.92 arc45 19.23,43.87 19.23,45.32 arc-45 20.43,48.21 24.32,52.1 arc45 25.8,55.67 25.8,57.95 arc-45 26.58,59.84 arc45 27.23,61.4 27.23,67.63 v27.38,67.79
  Bottom 0.25: IC5.52 15.02,37.68 arc45 15.78,37.36 17.04,37.36 arc90 v18.41,38.73 | v27.38,67.79 27.82,67.79 arc90 33.14,73.1 33.14,78.22 arc-45 33.45,78.98 34.85,80.37 v34.85,80.72
SW_REC  (via drill 0.35)
  Top 0.25: U$1.2 U$1.1 | v1.98,60.56 v5.08,60.56
  Bottom 0.25: U$1.1 arc45 6.94,107.67 5.67,106.39 arc45 5.08,104.98 5.08,101.7 arc90 6.21,100.57 arc-45 7.39,100.08 8.02,99.45 arc-45 8.68,97.87 8.68,94.64 arc-45 8,93.02 6.29,91.31 arc45 5.98,90.55 5.98,88.4 arc-45 5.65,87.62 5.39,87.35 arc45 5.2,86.89 arc-45 4.68,85.65 3.7,84.67 arc45 2.14,80.91 2.14,77.53 arc45 2.47,76.75 arc-45 2.59,76.46 2.59,61.16 v1.98,60.56 | v5.08,60.56 5.77,59.87 arc-45 6.11,59.06 arc45 7.07,56.75 8.99,54.82 8.99,52.28 arc45 9.2,51.78 9.71,51.27 arc45 9.88,51.2 18.97,51.2 19.29,50.88 19.29,44.03 arc45 19.42,43.71 arc-45 19.63,43.2 19.63,41.82 arc-45 19.43,41.34 18.91,40.82 arc-90 18.24,40.82 IC5.61
TEXTURE_CV
  Bottom 0.25: IC4.8 32.38,51.91 32.54,51.75 33.39,51.75 C11.2 R26.1 35.54,51.28 35.75,51.28 arc-90 36.71,50.32 36.71,46.14 arc-45 36.33,45.22 36.08,44.97 arc-45 35.01,44.53 34.3,44.53 arc90 31.22,41.45 arc-45 31.04,41.02 30.76,40.73 arc-45 30.03,40.43 arc90 29.21,39.61 29.21,37.19 arc-45 28.9,36.44 28.31,35.85 arc-90 27.02,35.85 26.02,36.85 arc-90 26.02,37.34 26.46,37.78 IC5.14
TEXTURE_POT
  Bottom 0.25: TEXTURE.P$2 30.01,38.89 arc45 29.66,38.05 29.66,36.92 arc-45 29.41,36.31 28.48,35.38 arc-90 26.84,35.38 26.58,35.64 arc45 25.92,35.91 22.95,35.91 arc45 21.79,35.43 21.61,35.25 arc45 21.24,34.36 21.24,34.26 arc90 22.16,33.34 24.04,33.34 arc-45 24.5,33.14 IC5.22
TX
  Bottom 0.25: U$4.1 arc90 13.6,25.98 13.6,28.45 arc-45 13.88,29.12 14.21,29.45 arc45 14.45,30.02 14.45,30.29 arc-45 14.77,31.07 IC5.42
V_OCT  (via drill 0.35)
  Top 0.25: v32.31,54.37 30.25,54.37 arc-45 v29.29,54.77
  Bottom 0.25: R34.1 C20.2 24.57,58.44 | 24.57,58.44 IC4.1 | 26.12,32.97 IC5.20 26.5,32.56 arc45 26.73,32.47 27.26,32.47 arc45 27.68,32.64 29.67,34.63 arc45 30.12,35.71 30.12,36.86 arc-45 30.48,37.76 31.39,38.66 arc45 31.67,39.34 31.67,41.08 arc-90 34.66,44.07 35.22,44.07 arc45 36.25,44.5 36.81,45.06 arc45 37.16,45.9 37.16,51.77 arc-45 37.3,52.12 37.48,52.29 arc45 37.67,52.75 37.67,53.08 arc45 37.42,53.69 37.23,53.87 arc90 35.8,53.87 35.3,53.38 arc-90 33.57,53.38 32.57,54.37 v32.31,54.37 | v29.29,54.77 27.69,54.77 arc-90 24.77,57.7 24.77,58.25 24.57,58.44
VCC  (via drill 0.35)
  Top 0.35: v11.43,11.03 v11.44,11.03 arc45 12.3,11.39 14.06,13.15 arc-45 14.64,13.39 16.12,13.39 arc-45 16.5,13.23 16.61,13.12 arc45 17.25,12.86 20.25,12.86 arc-45 20.5,12.75 20.65,12.6 arc45 21.14,12.4 32.95,12.4 arc45 33.46,12.61 arc-45 34.26,12.94 35.25,12.94 arc45 v36.2,13.34 | v39.13,15.24 arc45 39.46,16.02 39.46,36.54 arc45 38.49,38.87 38.38,38.98 arc-90 38.38,39.92 arc45 38.85,41.04 38.85,67.55 arc45 37.88,69.88 35.26,72.5 arc-90 35.26,73.55 38.98,77.27 arc45 39.46,78.42 39.46,87.05 arc45 38.26,89.93 v34.92,93.27 | v15.24,84.14 25.24,84.14 v25.72,84.61
  Top 0.406: v10.24,92.39 arc-45 8.88,92.95 v7.7,94.14
  Bottom 0.35: IC10.8 36.49,16.03 36.59,16.03 37.33,15.3 | 37.33,15.3 C38.1 38,15.24 v39.13,15.24 | 11.43,10.5 10.06,10.5 arc-45 9.39,10.78 IC9.8 | 11.43,10.5 C39.1 | 11.43,10.5 v11.43,11.03 | v36.2,13.34 36.2,13.54 arc-45 36.64,14.6 37.33,15.3 | v25.72,84.61 25.72,89.89 arc-90 29.09,93.27 v34.92,93.27 | v15.24,84.14 14.93,84.45 R11.1
  Bottom 0.406: D2.C 1.83,95.41 2.38,94.85 2.94,94.85 3.33,94.46 3.33,94.22 | 3.33,94.22 3.33,93.88 C1.+ | R11.1 13.49,86.36 | 13.49,86.36 12.29,87.56 arc-45 11.43,89.64 11.43,89.98 arc45 10.57,92.07 v10.24,92.39 | v7.7,94.14 3.41,94.14 3.33,94.22 | IC7.3 9.15,80.55 arc-45 10.19,83.06 13.49,86.36
VEE  (via drill 0.35)
  Top 0.35: v27.62,14.05 27.06,13.49 arc-45 25.78,12.96 21.34,12.96 arc-45 20.9,13.14 20.76,13.28 arc45 20.44,13.41 17.52,13.41 arc-45 16.81,13.7 16.7,13.81 arc45 16.38,13.94 14.4,13.94 arc45 13.7,13.65 12.39,12.34 arc-45 11.18,11.84 10.93,11.84 arc-90 9.29,13.48 arc-45 9.72,14.53 10.38,15.19 arc90 10.38,16.25 8.79,17.83 arc-45 v8.26,19.13 | v8.89,30.48 8.7,30.68 arc45 7.78,31.05 5.91,31.05 arc-45 5.05,31.41 3.2,33.27 arc-90 3.2,34.81 5.42,37.03 arc45 6.19,38.89 6.19,40.91 arc-45 6.95,42.75 v7.46,43.26 | v8.1,50.4 7.97,50.4 arc-90 4.13,54.25 4.13,58.52 arc-90 5.36,59.76 arc90 5.89,60.28 5.89,60.73 arc90 5.25,61.37 4.35,61.37 arc-90 1.64,64.08 1.64,96.14 arc-90 5.03,99.54 8.39,99.54 arc45 v9.92,100.17
  Bottom 0.35: IC10.4 27.93,12.86 C45.2 27.62,13.07 v27.62,14.05 | IC9.4 8.26,18.79 v8.26,19.13 8.49,19.37 C46.2 8.49,22.56 arc-45 8.59,22.8 8.75,22.95 arc45 8.87,23.25 8.87,23.61 arc-45 8.99,23.91 9.38,24.3 arc45 9.77,25.23 9.77,28.59 arc45 9.05,30.32 v8.89,30.48 | v8.1,50.4 8.32,50.18 8.32,44.68 arc-45 7.92,43.72 v7.46,43.26 | v9.92,100.17 15.82,100.17 arc-45 16.64,99.83 17.29,99.18 arc45 19.18,98.4 19.76,98.4 R30.1
  Bottom 0.406: D1.A 20.81,101.68 C13.- 20.64,100.67 20.64,99.85 20.56,99.77 20.24,99.77 arc90 19.84,99.38 R30.1